# EAGLE design tactileSensorI2c (EAGLE 9.6.0)
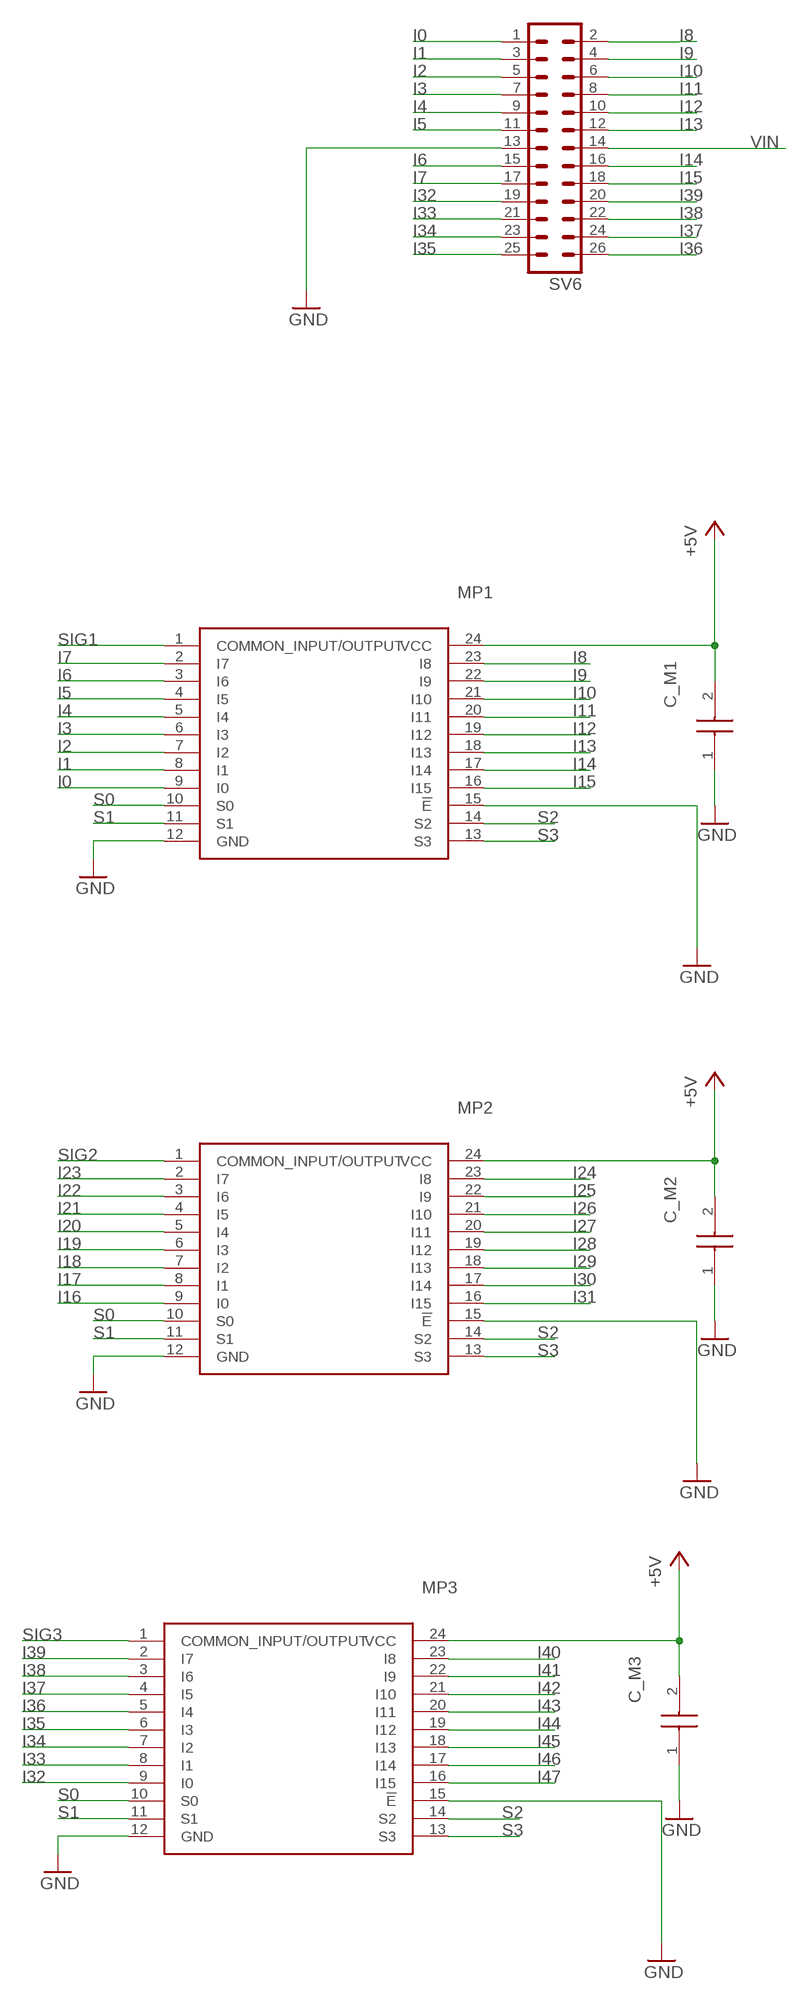
[diagram p0: schematic, sheet 1, part 1 of 2]
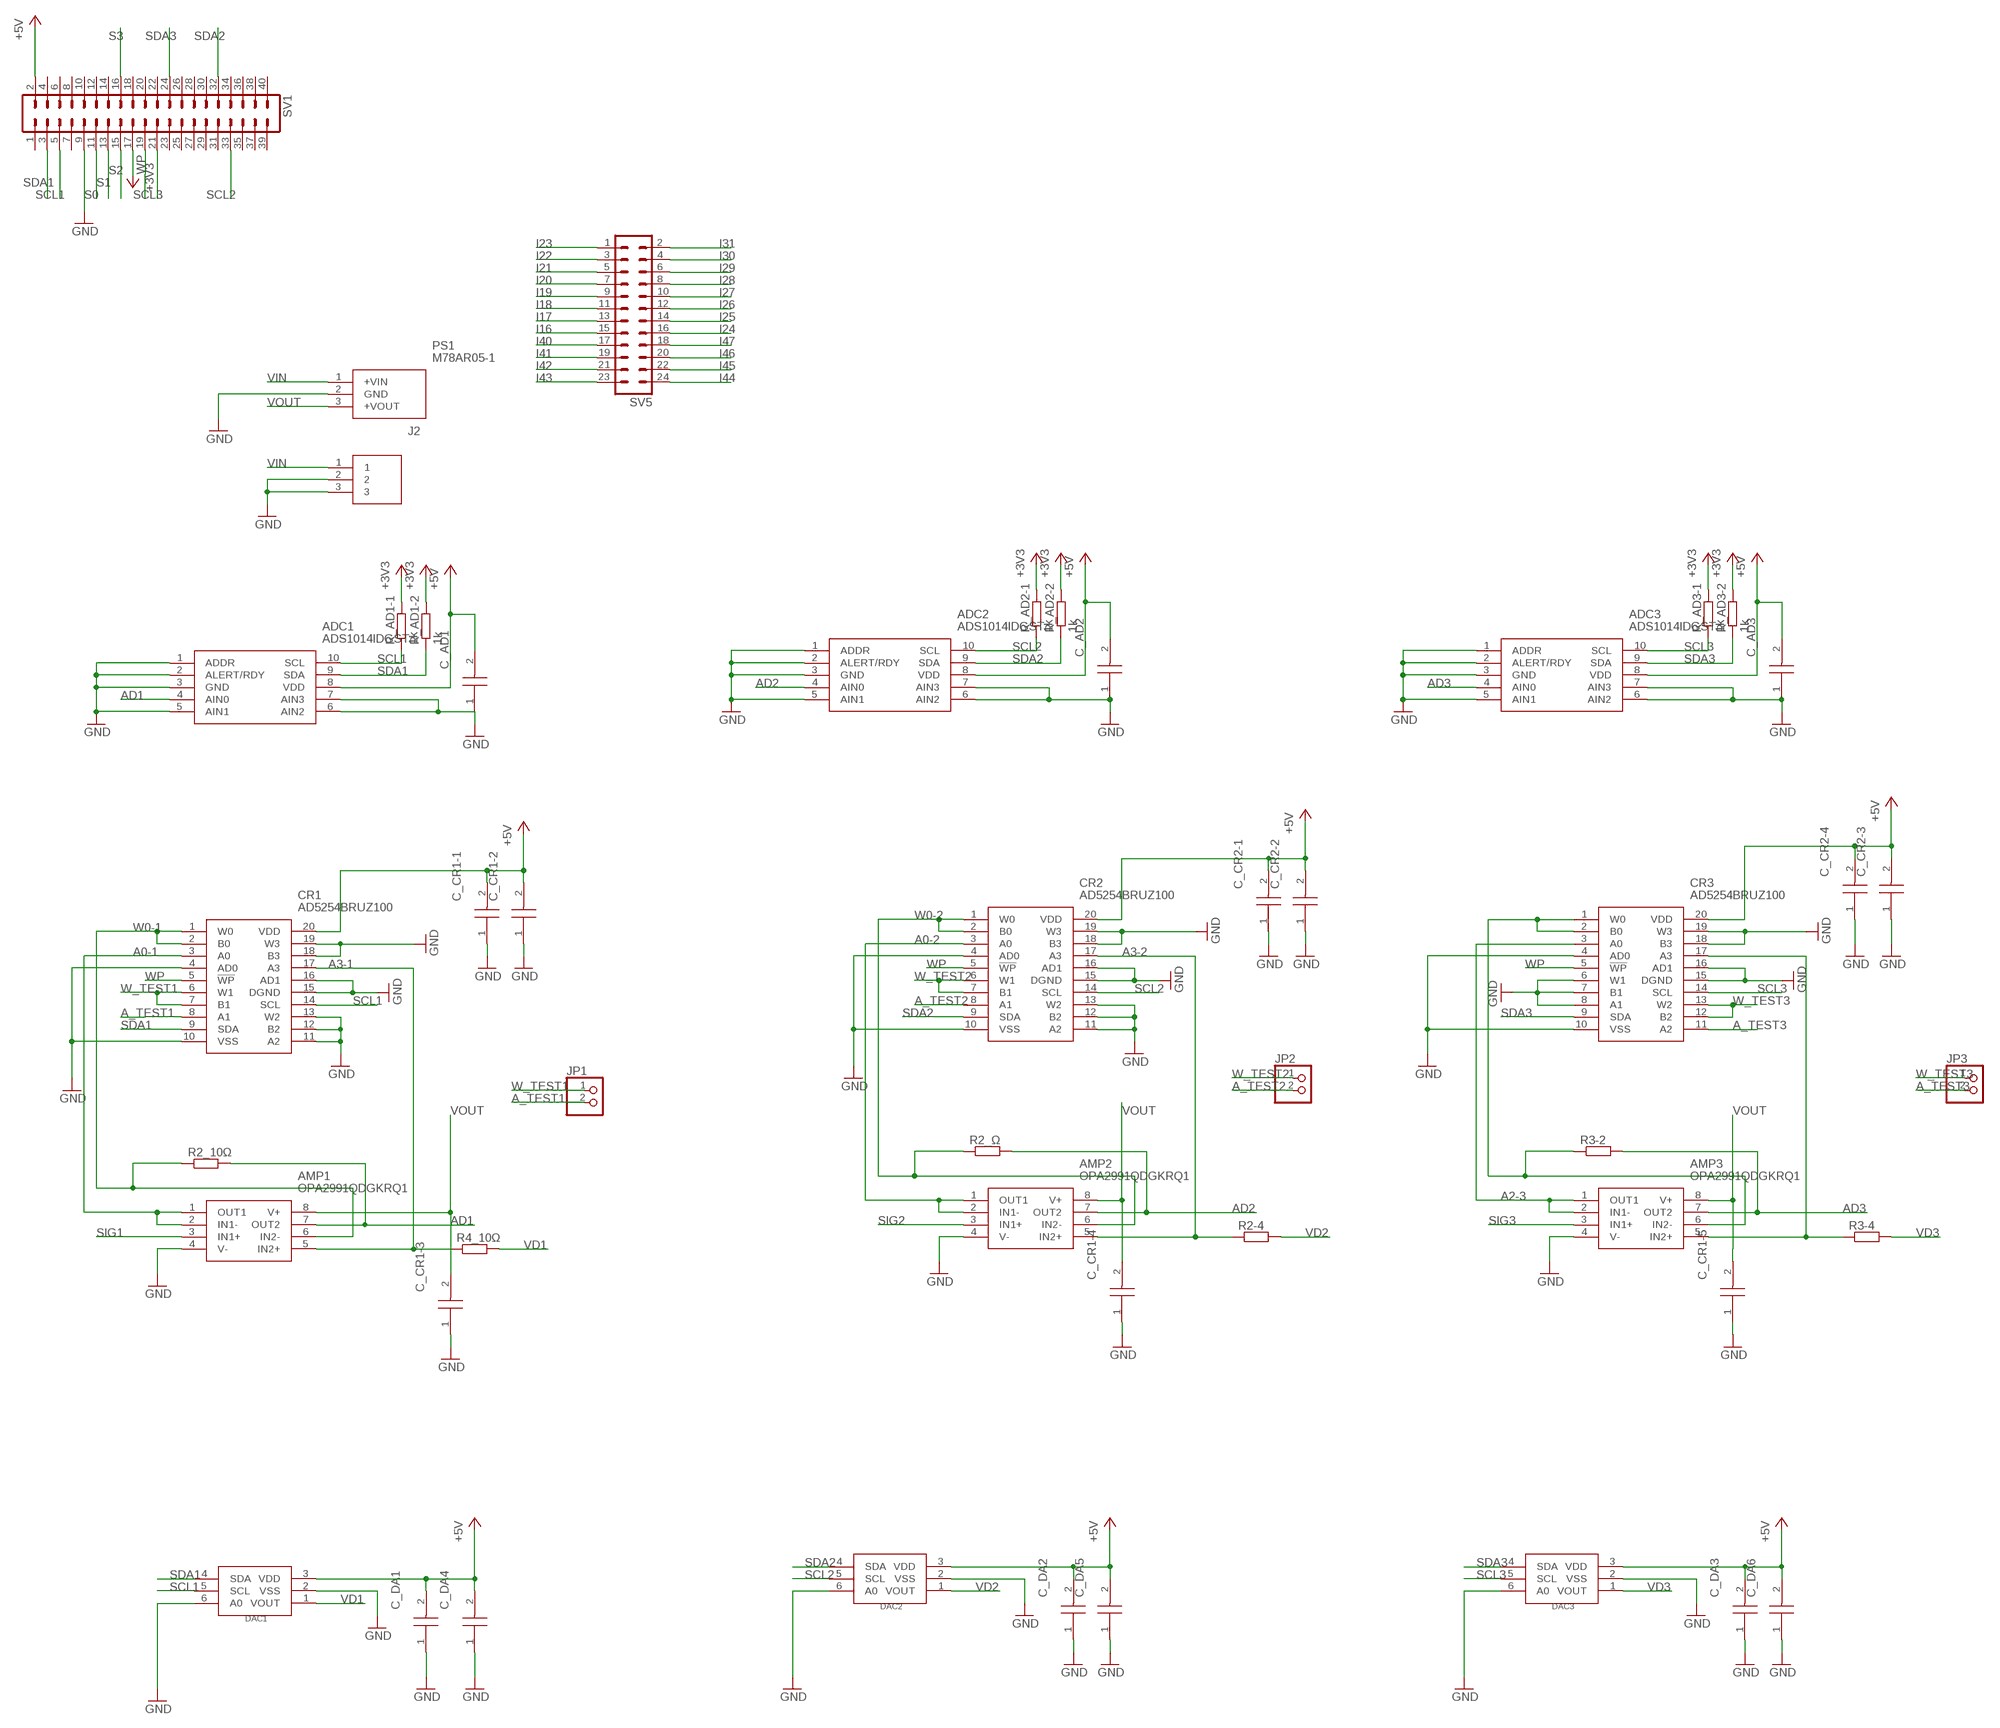
[diagram p1: schematic, sheet 1, part 2 of 2]

## Parts
ADC1  ADS1014IDGST  [SOP50P490X110-10N]
ADC2  ADS1014IDGST  [SOP50P490X110-10N]
ADC3  ADS1014IDGST  [SOP50P490X110-10N]
AMP1  OPA2991QDGKRQ1  [SOP65P490X110-8N]
AMP2  OPA2991QDGKRQ1  [SOP65P490X110-8N]
AMP3  OPA2991QDGKRQ1  [SOP65P490X110-8N]
C_AD1  0.1u  C0805C105J3RACTU  [CAPC2012X140N]
C_AD2  0.1u  C0805C105J3RACTU  [CAPC2012X140N]
C_AD3  0.1u  C0805C105J3RACTU  [CAPC2012X140N]
C_CR1-1  0.1u  C0805C105J3RACTU  [CAPC2012X140N]
C_CR1-2  10u  C0805C105J3RACTU  [CAPC2012X140N]
C_CR1-3  10u  C0805C105J3RACTU  [CAPC2012X140N]
C_CR1-4  10u  C0805C105J3RACTU  [CAPC2012X140N]
C_CR1-5  10u  C0805C105J3RACTU  [CAPC2012X140N]
C_CR2-1  0.1u  C0805C105J3RACTU  [CAPC2012X140N]
C_CR2-2  10u  C0805C105J3RACTU  [CAPC2012X140N]
C_CR2-3  C0805C105J3RACTU  [CAPC2012X140N]
C_CR2-4  C0805C105J3RACTU  [CAPC2012X140N]
C_DA1  C0805C105J3RACTU  [CAPC2012X140N]
C_DA2  C0805C105J3RACTU  [CAPC2012X140N]
C_DA3  C0805C105J3RACTU  [CAPC2012X140N]
C_DA4  C0805C105J3RACTU  [CAPC2012X140N]
C_DA5  C0805C105J3RACTU  [CAPC2012X140N]
C_DA6  C0805C105J3RACTU  [CAPC2012X140N]
C_M1  0.1u  C0805C105J3RACTU  [CAPC2012X140N]
C_M2  0.1u  C0805C105J3RACTU  [CAPC2012X140N]
C_M3  0.1u  C0805C105J3RACTU  [CAPC2012X140N]
CR1  AD5254BRUZ100  [SOP65P640X120-20N]
CR2  AD5254BRUZ100  [SOP65P640X120-20N]
CR3  AD5254BRUZ100  [SOP65P640X120-20N]
DAC1  MCP4725  [SOT23-6]
DAC2  MCP4725  [SOT23-6]
DAC3  MCP4725  [SOT23-6]
J2  1725669  [1725669]
JP1  PINHD-1X2  [1X02]
JP2  PINHD-1X2  [1X02]
JP3  PINHD-1X2  [1X02]
MP1  CD74HC4067SM96  [SOP65P780X200-24N]
MP2  CD74HC4067SM96  [SOP65P780X200-24N]
MP3  CD74HC4067SM96  [SOP65P780X200-24N]
PS1  M78AR05-1  [M78AR05]
R2-4  R-EU_0204/2V  [0204V]
R2_10Ω  R-EU_0204/2V  [0204V]
R2_Ω  R-EU_0204/2V  [0204V]
R3-2  R-EU_0204/2V  [0204V]
R3-4  R-EU_0204/2V  [0204V]
R4_10Ω  R-EU_0204/2V  [0204V]
R_AD1-1  1k  R-EU_R0805  [R0805]
R_AD1-2  1k  R-EU_R0805  [R0805]
R_AD2-1  1k  R-EU_R0805  [R0805]
R_AD2-2  1k  R-EU_R0805  [R0805]
R_AD3-1  1k  R-EU_R0805  [R0805]
R_AD3-2  1k  R-EU_R0805  [R0805]
SV1  MA20-2  [MA20-2]
SV5  MA12-2  [MA12-2]
SV6  MA13-2  [MA13-2]

## Nets
+3V3: R_AD1-1.2 R_AD1-2.2 R_AD2-1.2 R_AD2-2.2 R_AD3-1.2 R_AD3-2.2 SV1.17
+5V: ADC1.8(VDD) ADC2.8(VDD) ADC3.8(VDD) C_AD1.2 C_AD2.2 C_AD3.2 C_CR1-1.2 C_CR1-2.2 C_CR2-1.2 C_CR2-2.2 C_CR2-3.2 C_CR2-4.2 C_DA1.2 C_DA2.2 C_DA3.2 C_DA4.2 C_DA5.2 C_DA6.2 C_M1.2 C_M2.2 C_M3.2 CR1.20(VDD) CR2.20(VDD) CR3.20(VDD) DAC1.3(VDD) DAC2.3(VDD) DAC3.3(VDD) MP1.24(VCC) MP2.24(VCC) MP3.24(VCC) SV1.2
A0-1: AMP1.1(OUT1) AMP1.2(IN1-) CR1.3(A0)
A0-2: AMP2.1(OUT1) AMP2.2(IN1-) CR2.3(A0)
A1-3: AMP3.5(IN2+) CR3.17(A3) R3-4.1
A2-3: AMP3.1(OUT1) AMP3.2(IN1-) CR3.3(A0)
A3-1: AMP1.5(IN2+) CR1.17(A3) R4_10Ω.1
A3-2: AMP2.5(IN2+) CR2.17(A3) R2-4.1
A_TEST1: CR1.8(A1) JP1.2
A_TEST2: CR2.8(A1) JP2.2
A_TEST3: CR3.11(A2) JP3.2
AD1: ADC1.4(AIN0) AMP1.7(OUT2) R2_10Ω.2
AD2: ADC2.4(AIN0) AMP2.7(OUT2) R2_Ω.2
AD3: ADC3.4(AIN0) AMP3.7(OUT2) R3-2.2
GND: ADC1.1(ADDR) ADC1.2(ALERT/RDY) ADC1.3(GND) ADC1.5(AIN1) ADC1.6(AIN2) ADC1.7(AIN3) ADC2.1(ADDR) ADC2.2(ALERT/RDY) ADC2.3(GND) ADC2.5(AIN1) ADC2.6(AIN2) ADC2.7(AIN3) ADC3.1(ADDR) ADC3.2(ALERT/RDY) ADC3.3(GND) ADC3.5(AIN1) ADC3.6(AIN2) ADC3.7(AIN3) AMP1.4(V-) AMP2.4(V-) AMP3.4(V-) C_AD1.1 C_AD2.1 C_AD3.1 C_CR1-1.1 C_CR1-2.1 C_CR1-3.1 C_CR1-4.1 C_CR1-5.1 C_CR2-1.1 C_CR2-2.1 C_CR2-3.1 C_CR2-4.1 C_DA1.1 C_DA2.1 C_DA3.1 C_DA4.1 C_DA5.1 C_DA6.1 C_M1.1 C_M2.1 C_M3.1 CR1.4(AD0) CR1.10(VSS) CR1.11(A2) CR1.12(B2) CR1.13(W2) CR1.15(DGND) CR1.16(AD1) CR1.18(B3) CR1.19(W3) CR2.4(AD0) CR2.10(VSS) CR2.11(A2) CR2.12(B2) CR2.13(W2) CR2.15(DGND) CR2.16(AD1) CR2.18(B3) CR2.19(W3) CR3.4(AD0) CR3.6(W1) CR3.7(B1) CR3.8(A1) CR3.10(VSS) CR3.15(DGND) CR3.16(AD1) CR3.18(B3) CR3.19(W3) DAC1.2(VSS) DAC1.6(A0) DAC2.2(VSS) DAC2.6(A0) DAC3.2(VSS) DAC3.6(A0) J2.2 J2.3 MP1.12(GND) MP1.15(!E) MP2.12(GND) MP2.15(!E) MP3.12(GND) MP3.15(!E) PS1.2(GND) SV1.9 SV6.13
I0: MP1.9(I0) SV6.1
I1: MP1.8(I1) SV6.3
I2: MP1.7(I2) SV6.5
I3: MP1.6(I3) SV6.7
I4: MP1.5(I4) SV6.9
I5: MP1.4(I5) SV6.11
I6: MP1.3(I6) SV6.15
I7: MP1.2(I7) SV6.17
I8: MP1.23(I8) SV6.2
I9: MP1.22(I9) SV6.4
I10: MP1.21(I10) SV6.6
I11: MP1.20(I11) SV6.8
I12: MP1.19(I12) SV6.10
I13: MP1.18(I13) SV6.12
I14: MP1.17(I14) SV6.16
I15: MP1.16(I15) SV6.18
I16: MP2.9(I0) SV5.15
I17: MP2.8(I1) SV5.13
I18: MP2.7(I2) SV5.11
I19: MP2.6(I3) SV5.9
I20: MP2.5(I4) SV5.7
I21: MP2.4(I5) SV5.5
I22: MP2.3(I6) SV5.3
I23: MP2.2(I7) SV5.1
I24: MP2.23(I8) SV5.16
I25: MP2.22(I9) SV5.14
I26: MP2.21(I10) SV5.12
I27: MP2.20(I11) SV5.10
I28: MP2.19(I12) SV5.8
I29: MP2.18(I13) SV5.6
I30: MP2.17(I14) SV5.4
I31: MP2.16(I15) SV5.2
I32: MP3.9(I0) SV6.19
I33: MP3.8(I1) SV6.21
I34: MP3.7(I2) SV6.23
I35: MP3.6(I3) SV6.25
I36: MP3.5(I4) SV6.26
I37: MP3.4(I5) SV6.24
I38: MP3.3(I6) SV6.22
I39: MP3.2(I7) SV6.20
I40: MP3.23(I8) SV5.17
I41: MP3.22(I9) SV5.19
I42: MP3.21(I10) SV5.21
I43: MP3.20(I11) SV5.23
I44: MP3.19(I12) SV5.24
I45: MP3.18(I13) SV5.22
I46: MP3.17(I14) SV5.20
I47: MP3.16(I15) SV5.18
S0: MP1.10(S0) MP2.10(S0) MP3.10(S0) SV1.11
S1: MP1.11(S1) MP2.11(S1) MP3.11(S1) SV1.13
S2: MP1.14(S2) MP2.14(S2) MP3.14(S2) SV1.15
S3: MP1.13(S3) MP2.13(S3) MP3.13(S3) SV1.16
SCL1: ADC1.10(SCL) CR1.14(SCL) DAC1.5(SCL) R_AD1-1.1 SV1.5
SCL2: ADC2.10(SCL) CR2.14(SCL) DAC2.5(SCL) R_AD2-1.1 SV1.33
SCL3: ADC3.10(SCL) CR3.14(SCL) DAC3.5(SCL) R_AD3-1.1 SV1.21
SDA1: ADC1.9(SDA) CR1.9(SDA) DAC1.4(SDA) R_AD1-2.1 SV1.3
SDA2: ADC2.9(SDA) CR2.9(SDA) DAC2.4(SDA) R_AD2-2.1 SV1.32
SDA3: ADC3.9(SDA) CR3.9(SDA) DAC3.4(SDA) R_AD3-2.1 SV1.24
SIG1: AMP1.3(IN1+) MP1.1(COMMON_INPUT/OUTPUT)
SIG2: AMP2.3(IN1+) MP2.1(COMMON_INPUT/OUTPUT)
SIG3: AMP3.3(IN1+) MP3.1(COMMON_INPUT/OUTPUT)
VD1: DAC1.1(VOUT) R4_10Ω.2
VD2: DAC2.1(VOUT) R2-4.2
VD3: DAC3.1(VOUT) R3-4.2
VIN: J2.1 PS1.1(+VIN) SV6.14
VOUT: AMP1.8(V+) AMP2.8(V+) AMP3.8(V+) C_CR1-3.2 C_CR1-4.2 C_CR1-5.2 PS1.3(+VOUT)
W0-1: AMP1.6(IN2-) CR1.1(W0) CR1.2(B0) R2_10Ω.1
W0-2: AMP2.6(IN2-) CR2.1(W0) CR2.2(B0) R2_Ω.1
W1-3: AMP3.6(IN2-) CR3.1(W0) CR3.2(B0) R3-2.1
W_TEST1: CR1.6(W1) CR1.7(B1) JP1.1
W_TEST2: CR2.6(W1) CR2.7(B1) JP2.1
W_TEST3: CR3.12(B2) CR3.13(W2) JP3.1
WP: CR1.5(!WP) CR2.5(!WP) CR3.5(!WP) SV1.19
Unconnected: SV1.1 SV1.4 SV1.6 SV1.7 SV1.8 SV1.10 SV1.12 SV1.14 SV1.18 SV1.20 SV1.22 SV1.23 SV1.25 SV1.26 SV1.27 SV1.28 SV1.29 SV1.30 SV1.31 SV1.34 SV1.35 SV1.36 SV1.37 SV1.38 SV1.39 SV1.40

## Library data of the parts
ADC1-ADC3 = SamacSys_Parts:ADS1014IDGST: 12-Bit 3.3kSPS 1-Ch Delta-Sigma ADC With PGA, Oscillator, Voltage Reference, Comparator, and I2C Source: Datasheet <http://uk.rs-online.com/web/p/products/7094557P>; DESCRIPTION: 12-Bit 3.3kSPS 1-Ch Delta-Sigma ADC With PGA, Oscillator, Voltage Reference, Comparator, and I2C; HEIGHT: 1.1mm; MANUFACTURER_NAME: Texas Instruments; MANUFACTURER_PART_NUMBER: ADS1014IDGST; RS_PART_NUMBER: 7094557P; RS_PRICE-STOCK: http://uk.rs-online.com/web/p/products/7094557P
AMP1-AMP3 = SamacSys_Parts:OPA2991QDGKRQ1: Operational Amplifiers - Op Amps Automotive 2-channel, 40-V rail-to-rail input/output, low offset voltage, low noise op amp 8-VSSOP -40 to 125 Source: Datasheet <https://www.ti.com/lit/gpn/opa2991-q1>; DESCRIPTION: Operational Amplifiers - Op Amps Automotive&nbsp;2-channel, 40-V rail-to-rail input/output, low offset voltage, low noise op amp 8-VSSOP -40 to 125; HEIGHT: 1.1mm; MANUFACTURER_NAME: Texas Instruments; MANUFACTURER_PART_NUMBER: OPA2991QDGKRQ1
C_AD1-C_AD3 C_CR1-1-C_CR1-5 C_CR2-1-C_CR2-4 C_DA1-C_DA6 C_M1-C_M3 = SamacSys_Parts:C0805C105J3RACTU: KEMET - C0805C105J3RACTU - CAP, MLCC, X7R, 1UF, 25V, 0805 Source: Datasheet <http://uk.rs-online.com/web/p/products/1464275P>; DESCRIPTION: KEMET - C0805C105J3RACTU - CAP, MLCC, X7R, 1UF, 25V, 0805; HEIGHT: 1.4mm; MANUFACTURER_NAME: Kemet; MANUFACTURER_PART_NUMBER: C0805C105J3RACTU; RS_PART_NUMBER: 1464275P; RS_PRICE-STOCK: http://uk.rs-online.com/web/p/products/1464275P
CR1-CR3 = SamacSys_Parts:AD5254BRUZ100: AD5254BRUZ100, Digital Potentiometer 100k 256-Position Linear 4-channel Serial-2 Wire, Serial-I2C 20-Pin TSSOP Source: Datasheet <http://uk.rs-online.com/web/p/products/5384858P>; DESCRIPTION: AD5254BRUZ100, Digital Potentiometer 100k 256-Position Linear 4-channel Serial-2 Wire, Serial-I2C 20-Pin TSSOP; HEIGHT: 1.2mm; MANUFACTURER_NAME: Analog Devices; MANUFACTURER_PART_NUMBER: AD5254BRUZ100; RS_PART_NUMBER: 5384858P; RS_PRICE-STOCK: http://uk.rs-online.com/web/p/products/5384858P
DAC1-DAC3 = microchip-update-2:MCP4725: 12-Bit Digital-to-Analog Converter with EEPROM Memory in SOT-23-6
J2 = 1725669:1725669: 3 way PCB vertical mount terminal,2.54mm 3 way PCB vertical mount terminal,2.54mm Source: Datasheet <https://www.phoenixcontact.com/online/portal/gb?uri=pxc-oc-itemdetail:pid=1725669&library=gben&tab=1>; ARROW_PART_NUMBER: 1725669; ARROW_PRICE-STOCK: https://www.arrow.com/en/products/1725669/phoenix-contact?region=nac; DESCRIPTION: 3 way PCB vertical mount terminal,2.54mm 3 way PCB vertical mount terminal,2.54mm; HEIGHT: 8.5mm; MANUFACTURER_NAME: Phoenix Contact; MANUFACTURER_PART_NUMBER: 1725669; MOUSER_PART_NUMBER: 651-1725669; MOUSER_PRICE-STOCK: https://www.mouser.co.uk/ProductDetail/Phoenix-Contact/1725669?qs=A%2FKWGUWTCZjmkTL0Oe91ew%3D%3D
JP1-JP3 = pinhead:PINHD-1X2: PIN HEADER
MP1-MP3 = SamacSys_Parts:CD74HC4067SM96: High Speed CMOS 16-Ch MUX/DEMUX 24P SOIC CD74HC4067SM96, Multiplexer/Demultiplexer Single 16:1, 3 V, 5 V, 24-Pin, SSOP, 1 Source: Datasheet <http://docs-emea.rs-online.com/webdocs/0c95/0900766b80c95708.pdf>; ARROW_PART_NUMBER: CD74HC4067SM96; ARROW_PRICE-STOCK: https://www.arrow.com/en/products/cd74hc4067sm96/texas-instruments; DESCRIPTION: High Speed CMOS 16-Ch MUX/DEMUX 24P SOIC CD74HC4067SM96, Multiplexer/Demultiplexer Single 16:1, 3 V, 5 V, 24-Pin, SSOP, 1; HEIGHT: 2mm; MANUFACTURER_NAME: Texas Instruments; MANUFACTURER_PART_NUMBER: CD74HC4067SM96; MOUSER_PART_NUMBER: 595-CD74HC4067SM96; MOUSER_PRICE-STOCK: https://www.mouser.co.uk/ProductDetail/Texas-Instruments/CD74HC4067SM96?qs=JHHQeKcAU3DyfvAOSRLjhQ%3D%3D
PS1 = SamacSys_Parts:M78AR05-1: Switching Regulator 1A, SIP Package Source: Datasheet <https://www.minmax.com.tw/en/download/files/692/M78AR-1_Datasheet.pdf>; DESCRIPTION: Switching Regulator 1A, SIP Package; HEIGHT: mm; MANUFACTURER_NAME: Minmax; MANUFACTURER_PART_NUMBER: M78AR05-1
R2-4 R2_10Ω R2_Ω R3-2 R3-4 R4_10Ω R_AD1-1 R_AD1-2 R_AD2-1 R_AD2-2 R_AD3-1 R_AD3-2 = rcl:R-EU_: RESISTOR, European symbol; SPICEPREFIX: R
SV1 = con-lstb:MA20-2: PIN HEADER; OC_FARNELL: unknown; OC_NEWARK: unknown
SV5 = con-lstb:MA12-2: PIN HEADER; OC_FARNELL: unknown; OC_NEWARK: unknown
SV6 = con-lstb:MA13-2: PIN HEADER; OC_FARNELL: unknown; OC_NEWARK: unknown

## Board
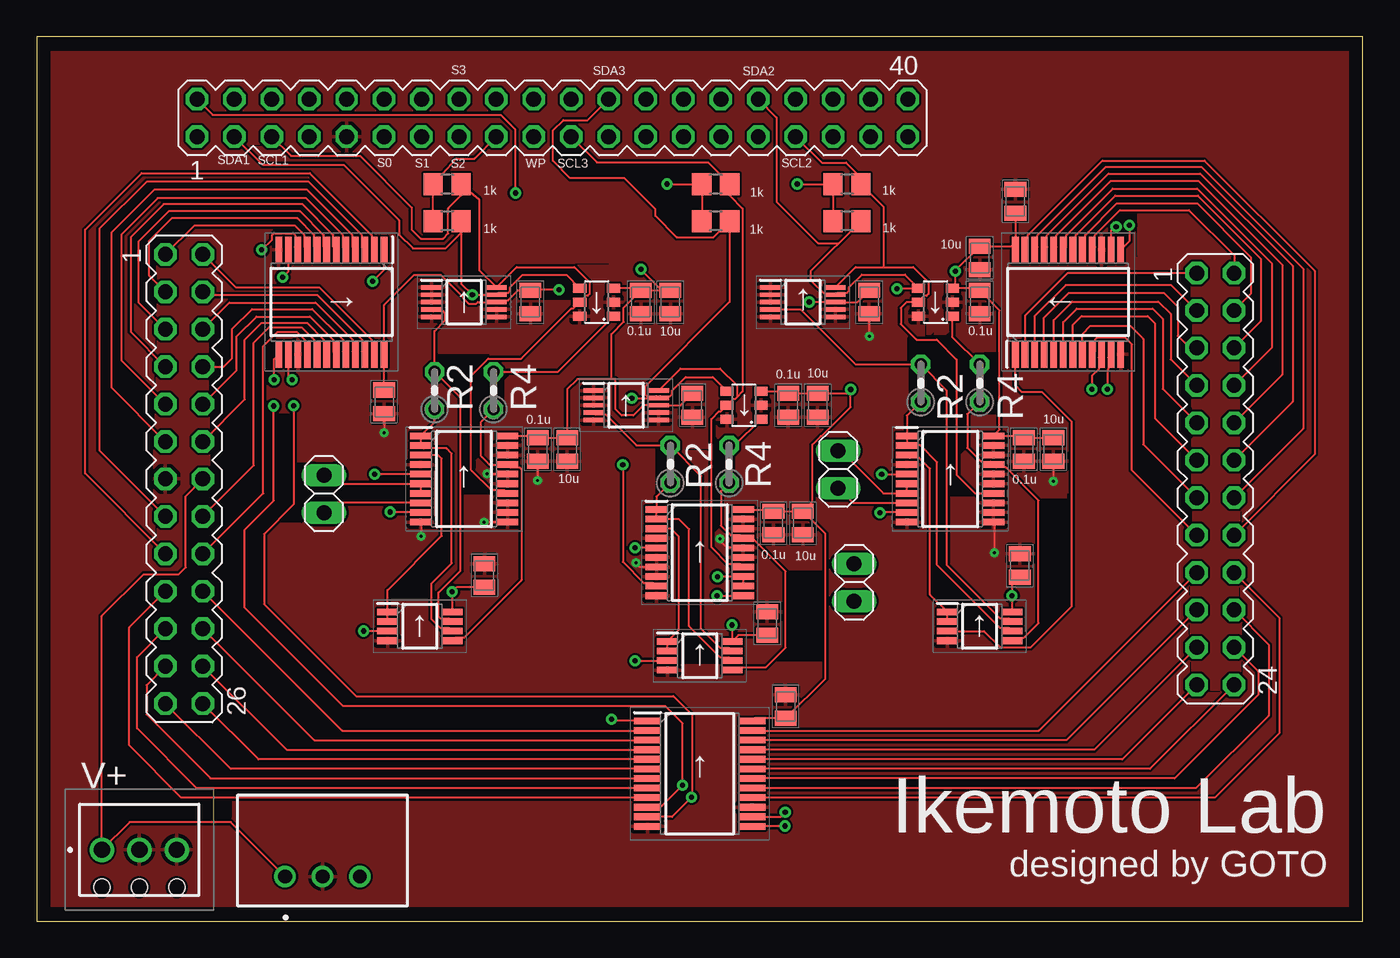
[diagram p2: board, top side]
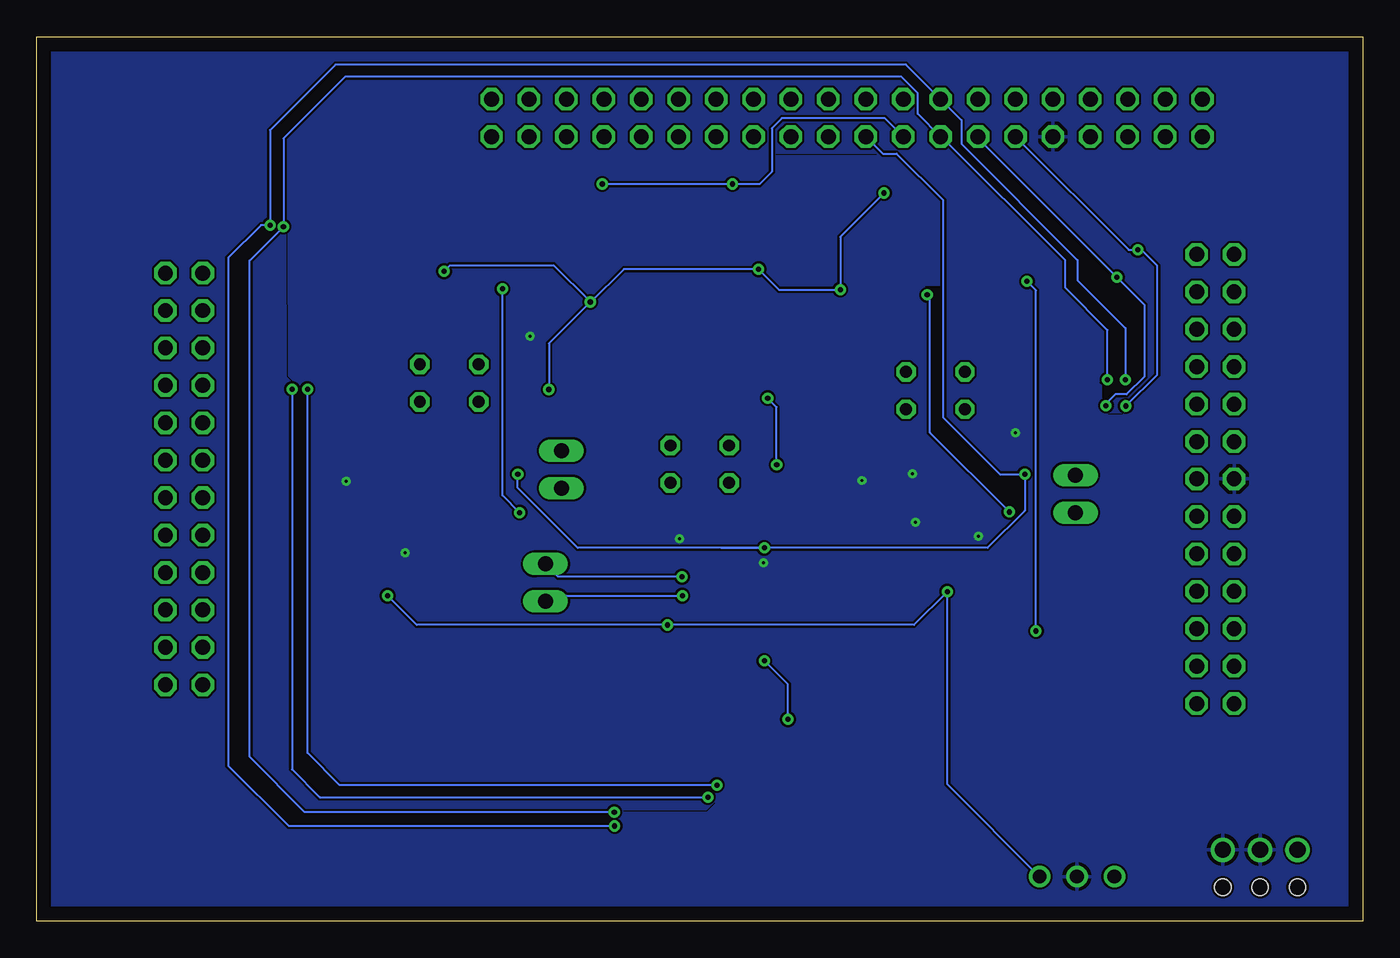
[diagram p3: board, bottom side, seen from below]

Size 90 x 60 mm. Coordinates in mm from the lower left corner, seen from the top.
Outline: 0,0 90,0 90,60 0,60 0,0
Copper layers (1*16): Top 0.035mm / dielectric 1.5mm / Bottom 0.035mm
Design rules "PCBGoGo": minimum track width 6mil, minimum drill 0.2mm, track to track 6mil, track to pad 6mil, pad to pad 6mil, via to via 6mil, smd to smd 6mil, copper to edge 0.2mm, drill to drill 6mil, minimum pad ring 10mil, minimum via ring 8mil, stop-mask expansion 4mil, vias tented up to drill 0mil, thermal gap 10mil
tRestrict: 126 lines
bRestrict: 11 lines

### Footprints (pad centres in the part's own frame; a part is rotated, then mirrored left to right if it is on the bottom)
SOP50P490X110-10N = smd 1.4 x 0.3: 1 -2.2,1; 2 -2.2,0.5; 3 -2.2,0; 4 -2.2,-0.5; 5 -2.2,-1; 6 2.2,-1; 7 2.2,-0.5; 8 2.2,0; 9 2.2,0.5; 10 2.2,1
SOP65P490X110-8N = smd 1.4 x 0.45: 1 -2.2,0.975; 2 -2.2,0.325; 3 -2.2,-0.325; 4 -2.2,-0.975; 5 2.2,-0.975; 6 2.2,-0.325; 7 2.2,0.325; 8 2.2,0.975
CAPC2012X140N = smd 1.02 x 1.47: 1 -0.8,0; 2 0.8,0
SOP65P640X120-20N = smd 1.475 x 0.45: 1 -2.938,2.925; 2 -2.938,2.275; 3 -2.938,1.625; 4 -2.938,0.975; 5 -2.938,0.325; 6 -2.938,-0.325; 7 -2.938,-0.975; 8 -2.938,-1.625; 9 -2.938,-2.275; 10 -2.938,-2.925; 11 2.938,-2.925; 12 2.938,-2.275; 13 2.938,-1.625; 14 2.938,-0.975; 15 2.938,-0.325; 16 2.938,0.325; 17 2.938,0.975; 18 2.938,1.625; 19 2.938,2.275; 20 2.938,2.925
SOT23-6 = smd 0.6 x 0.9: 1 -0.95,-1.15; 2 0,-1.15; 3 0.95,-1.15; 4 0.95,1.15; 5 0,1.15; 6 -0.95,1.15
1725669 = drill 1.1 pad 1.65: 1 0,0; 2 2.54,0; 3 5.08,0 | hole 1.1: 0,-2.54; 2.54,-2.54; 5.08,-2.54
1X02 = drill 1.016 long: 1 -1.27,0; 2 1.27,0
SOP65P780X200-24N = smd 1.8 x 0.45: 1 -3.55,3.575; 2 -3.55,2.925; 3 -3.55,2.275; 4 -3.55,1.625; 5 -3.55,0.975; 6 -3.55,0.325; 7 -3.55,-0.325; 8 -3.55,-0.975; 9 -3.55,-1.625; 10 -3.55,-2.275; 11 -3.55,-2.925; 12 -3.55,-3.575; 13 3.55,-3.575; 14 3.55,-2.925; 15 3.55,-2.275; 16 3.55,-1.625; 17 3.55,-0.975; 18 3.55,-0.325; 19 3.55,0.325; 20 3.55,0.975; 21 3.55,1.625; 22 3.55,2.275; 23 3.55,2.925; 24 3.55,3.575
M78AR05 = drill 0.94 pad 1.44: 1 -2.54,2; 2 0,2; 3 2.54,2
0204V = drill 0.813 octagon: 1 -1.27,0; 2 1.27,0
R0805 = smd 1.3 x 1.5: 1 -0.95,0; 2 0.95,0
MA20-2 = drill 1.016 octagon: 1 -24.13,-1.27; 2 -24.13,1.27; 3 -21.59,-1.27; 4 -21.59,1.27; 5 -19.05,-1.27; 6 -19.05,1.27; 7 -16.51,-1.27; 8 -16.51,1.27; 9 -13.97,-1.27; 10 -13.97,1.27; 11 -11.43,-1.27; 12 -11.43,1.27; 13 -8.89,-1.27; 14 -8.89,1.27; 15 -6.35,-1.27; 16 -6.35,1.27; 17 -3.81,-1.27; 18 -3.81,1.27; 19 -1.27,-1.27; 20 -1.27,1.27; 21 1.27,-1.27; 22 1.27,1.27; 23 3.81,-1.27; 24 3.81,1.27; 25 6.35,-1.27; 26 6.35,1.27; 27 8.89,-1.27; 28 8.89,1.27; 29 11.43,-1.27; 30 11.43,1.27; 31 13.97,-1.27; 32 13.97,1.27; 33 16.51,-1.27; 34 16.51,1.27; 35 19.05,-1.27; 36 19.05,1.27; 37 21.59,-1.27; 38 21.59,1.27; 39 24.13,-1.27; 40 24.13,1.27
MA12-2 = drill 1.016 octagon: 1 -13.97,-1.27; 2 -13.97,1.27; 3 -11.43,-1.27; 4 -11.43,1.27; 5 -8.89,-1.27; 6 -8.89,1.27; 7 -6.35,-1.27; 8 -6.35,1.27; 9 -3.81,-1.27; 10 -3.81,1.27; 11 -1.27,-1.27; 12 -1.27,1.27; 13 1.27,-1.27; 14 1.27,1.27; 15 3.81,-1.27; 16 3.81,1.27; 17 6.35,-1.27; 18 6.35,1.27; 19 8.89,-1.27; 20 8.89,1.27; 21 11.43,-1.27; 22 11.43,1.27; 23 13.97,-1.27; 24 13.97,1.27
MA13-2 = drill 1.016 octagon: 1 -15.24,-1.27; 2 -15.24,1.27; 3 -12.7,-1.27; 4 -12.7,1.27; 5 -10.16,-1.27; 6 -10.16,1.27; 7 -7.62,-1.27; 8 -7.62,1.27; 9 -5.08,-1.27; 10 -5.08,1.27; 11 -2.54,-1.27; 12 -2.54,1.27; 13 0,-1.27; 14 0,1.27; 15 2.54,-1.27; 16 2.54,1.27; 17 5.08,-1.27; 18 5.08,1.27; 19 7.62,-1.27; 20 7.62,1.27; 21 10.16,-1.27; 22 10.16,1.27; 23 12.7,-1.27; 24 12.7,1.27; 25 15.24,-1.27; 26 15.24,1.27

### Placement (x,y rotation side)
ADC1  29,42 0 top
ADC2  52,42 0 top
ADC3  40,35 0 top
AMP1  26,20 0 top
AMP2  64,20 0 top
AMP3  45,18 0 top
C_AD1  33.5,42 90 top
C_AD2  56.5,42 90 top
C_AD3  44.5,35 90 top
C_CR1-1  34,32 90 top
C_CR1-2  36,32 90 top
C_CR1-3  30.39,23.46 270 top
C_CR1-4  49.58,20.2 270 top
C_CR1-5  66.73,24.12 270 top
C_CR2-1  69,32 90 top
C_CR2-2  67,32 90 top
C_CR2-3  50,27 90 top
C_CR2-4  52,27 90 top
C_DA1  41,42 90 top
C_DA2  64,42 90 top
C_DA3  51,35 90 top
C_DA4  43,42 90 top
C_DA5  64,45 90 top
C_DA6  53,35 90 top
C_M1  23.58,35.23 90 top
C_M2  66.42,48.84 270 top
C_M3  50.83,14.56 270 top
CR1  29,30 0 top
CR2  62,30 0 top
CR3  45,25 0 top
DAC1  38,42 90 top
DAC2  61,42 90 top
DAC3  48,35 90 top
J2  4.42,4.83 0 top
JP1  19.49,28.99 270 top
JP2  54.39,30.65 270 top
JP3  55.48,22.97 270 top
MP1  20,42 270 top
MP2  70,42 90 top
MP3  45,10 0 top
PS1  19.39,1.02 0 top
R2-4  64,36.5 90 top
R2_10Ω  27,36 90 top
R2_Ω  60,36.5 90 top
R3-2  43,31 90 top
R3-4  47,31 90 top
R4_10Ω  31,36 90 top
R_AD1-1  27.86,50 180 top
R_AD1-2  27.86,47.5 180 top
R_AD2-1  55,50 180 top
R_AD2-2  55,47.5 180 top
R_AD3-1  46.09,50 180 top
R_AD3-2  46.09,47.5 180 top
SV1  35,54.5 0 top
SV5  80,30 270 top
SV6  10,30 270 top

### Tracks (layer width: path | path; a pad name or v marks a point on that pad's centre or on a via)
+3V3  (via drill 0.35)
  Top 0.152: SV1.17 29.7,51.74 28.46,51.74 26.95,50.05 R_AD1-1.2 R_AD1-2.2 | v51.61,50.01 54.04,50.01 R_AD2-1.2 R_AD2-2.2 | v42.77,50.01 45.13,50.01 R_AD3-1.2 R_AD3-2.2
  Bottom 0.152: SV1.17 32.44,54.48 39.42,54.48 40.11,53.8 40.11,50.85 40.95,50.01 v42.77,50.01 v51.61,50.01
+5V  (via drill 0.35)
  Top 0.152: SV1.2 11.93,54.71 31.47,54.71 32.49,53.7 v32.49,49.4 | C_M2.2 MP2.24 66.17,45.8 C_DA5.2 62.36,44.16 v62.36,44.09 62.36,43.16 DAC2.3 63.85,42.95 C_DA2.2 65.35,41.45 65.35,33.34 CR2.20 66.88,32.92 C_CR2-2.2 C_CR2-1.2 | MP3.24 48.74,13.76 C_M3.2 53.52,16.45 53.52,26.28 C_CR2-4.2 | CR1.20 33.88,32.92 C_CR1-1.2 C_CR1-2.2 36,36.08 36.7,36.78 39,36.78 | DAC1.3 40.85,42.95 C_DA1.2 | C_M1.2 MP1.24 23.57,41.81 25.6,43.84 27.41,43.84 28.96,42.29 28.96,42.24 29.31,41.89 29.82,41.89 29.93,42 ADC1.8 31.32,42.12 32,42.12 32.67,42.8 C_AD1.2 33.55,42.85 v35.46,42.85 | CR3.20 49.88,27.93 C_CR2-3.2 C_CR2-4.2 | C_AD3.2 43.7,35 ADC3.8 41.17,35 40.49,34.31 39.7,34.31 39.29,34.72 39.29,36.78 39,36.78 | C_AD2.2 55.7,42 ADC2.8 54.19,42.01 v52.43,42.01 | v41.01,44.23 41,44.22 42.42,42.8 C_DA4.2 C_DA1.2 | DAC3.3 50.85,35.95 C_DA3.2 C_DA6.2 54.98,35.8 v55.24,36.07 v55.23,36.08 55.23,34.87 53.27,32.91 53.22,32.91 52.64,32.33 52.64,28.44 C_CR2-4.2 | C_DA1.2 39.83,41.63 39.83,40.66 39,39.83 39,36.78
  Bottom 0.152: v32.49,49.4 35.46,46.43 v35.46,42.85 39.62,42.85 v41.01,44.23 50.15,44.23 52.4,41.99 v52.43,42.01 | v62.36,44.09 61.95,44.5 54.91,44.5 v52.43,42.01 | v52.43,42.01 55.24,39.19 v55.24,36.07
A0-1
  Top 0.152: AMP1.2 AMP1.1 23.8,22.45 27.48,26.13 27.48,31.37 27.23,31.62 CR1.3
A0-2
  Top 0.152: AMP2.2 AMP2.1 60.63,22.14 60.63,30.69 59.89,31.43 59.26,31.43 CR2.3
A1-3
  Top 0.152: R3-4.1 46.44,29.17 46.44,26.84 47.11,26.17 47.74,26.17 CR3.17 48.57,25.98 50.83,23.72 50.83,18.55 49.49,17.22 47.4,17.22 AMP3.5
A2-3
  Top 0.152: CR3.3 43.05,26.62 43.59,26.09 43.59,19.76 AMP3.1 AMP3.2
A3-1
  Top 0.152: AMP1.5 28.4,19.22 29,19.22 32.9,23.13 32.9,30.64 32.77,30.78 32.13,30.78 CR1.17 30.72,30.98 30.15,31.55 30.15,33.88 R4_10Ω.1
A3-2
  Top 0.152: AMP2.5 66.4,19.22 67,19.22 68,20.22 68,28.55 65.77,30.78 65.13,30.78 CR2.17 64.74,31.17 64.11,31.17 63.16,32.12 63.16,34.39 R2-4.1
A_TEST1
  Top 0.152: CR1.8 20.15,28.38 JP1.2
A_TEST2
  Top 0.152: JP2.2 55.39,28.38 CR2.8
A_TEST3  (via drill 0.35)
  Top 0.152: v46.18,22.07 CR3.11
  Bottom 0.152: JP3.2 55.11,22.07 v46.18,22.07
AD1
  Top 0.152: ADC1.4 26.92,41.38 27.59,41.38 27.73,41.24 27.73,40.76 27,40.03 R2_10Ω.2 28.75,35.52 28.75,23.77 27.27,22.29 27.27,20.66 27.41,20.52 28,20.52 AMP1.7
AD2
  Top 0.152: AMP2.7 66,20.52 65.41,20.52 61.77,24.15 61.77,36 R2_Ω.2 55.58,37.77 51.84,41.5 ADC2.4
AD3
  Top 0.152: AMP3.7 47,18.52 46.41,18.52 45.09,19.84 45.09,30.18 R3-2.2 40.7,32.27 38.59,34.38 37.92,34.38 ADC3.4
GND  (via drill 0.2, 0.2 pad 0.55)
  Top 0.152: CR2.11 65,27.01 v65,25 | C_CR1-1.1 34,29.91 v33.98,29.9 | CR1.16 30.53,30.32 30.53,30.33 v30.57,30.36 | CR1.11 v30.35,27.07 v30.35,27.08 | CR1.10 26.09,27.05 v26.09,26.11 | C_M1.1 v23.58,33.15 v23.57,33.15 | CR3.16 46.86,25.32 46.39,25.8 v46.39,25.93 | C_AD2.1 56.5,39.69 v56.52,39.67 | CR3.7 40.95,24.02 40.66,24.31 v40.68,24.33 | C_CR2-1.1 69,29.88 68.99,29.87 v69,29.86
  pour Top: 1,59 89,59 89,1 1,1
  pour Bottom: 1,59 1,1 89,1 89,59
I0
  Top 0.152: MP1.9 18.18,45.75 18.18,46.55 17.53,47.19 10.68,47.19 SV6.1
I1
  Top 0.152: MP1.8 18.83,45.75 18.83,46.55 17.7,47.68 9.14,47.68 7.59,46.13 7.59,43.84 SV6.3
I2
  Top 0.152: MP1.7 19.48,45.75 19.48,46.55 17.86,48.16 8.94,48.16 6.88,46.1 6.88,42.01 SV6.5
I3
  Top 0.152: MP1.6 20.13,45.75 20.13,46.55 18.03,48.64 8.61,48.64 6.38,46.41 6.38,39.98 SV6.7
I4
  Top 0.152: MP1.5 20.78,45.75 20.78,46.55 18.28,49.05 8.2,49.05 5.74,46.58 5.74,38.07 SV6.9
I5
  Top 0.152: MP1.4 21.43,45.75 21.43,46.55 18.34,49.63 7.98,49.63 5.05,46.71 5.05,36.22 SV6.11
I6
  Top 0.152: MP1.3 22.08,45.75 22.08,46.55 18.46,50.16 7.44,50.16 4.24,46.96 4.24,31.95 SV6.15
I7
  Top 0.152: SV6.17 3.28,30.37 3.28,44 3.28,46.91 7.11,50.75 18.52,50.75 22.73,46.55 22.73,45.75 MP1.2
I8
  Top 0.152: SV6.2 13.51,43.01 19.17,43.01 22.73,39.45 22.73,38.65 MP1.23
I9
  Top 0.152: MP1.22 22.08,38.65 22.08,39.45 19.05,42.47 11.5,42.47 SV6.4
I10
  Top 0.152: SV6.6 13.07,41.96 18.91,41.96 21.43,39.45 21.43,38.65 MP1.21
I11
  Top 0.152: SV6.8 12.68,37.62 13.26,38.2 13.26,40.18 14.61,41.53 18.69,41.53 20.78,39.45 20.78,38.65 MP1.20
I12
  Top 0.152: SV6.10 13.56,37.37 13.56,39.67 14.91,41.02 18.55,41.02 20.13,39.45 20.13,38.65 MP1.19
I13
  Top 0.152: SV6.12 14.12,35.39 14.12,39.45 15.27,40.59 18.33,40.59 19.48,39.45 19.48,38.65 MP1.18
I14
  Top 0.152: SV6.16 14.73,30.92 14.73,39.24 15.77,40.28 17.99,40.28 18.83,39.45 18.83,38.65 MP1.17
I15
  Top 0.152: SV6.18 15.37,29.02 15.37,39.01 16.33,39.98 17.64,39.98 18.38,39.25 MP1.16
I16
  Top 0.152: SV5.15 74.35,30.57 74.35,39.13 73.89,39.58 71.95,39.58 71.82,39.45 71.82,38.65 MP2.9
I17
  Top 0.152: MP2.8 70.97,39.84 71.53,40.39 74.22,40.39 75.11,39.5 75.11,32.35 SV5.13
I18
  Top 0.152: MP2.7 70.33,40.45 70.92,41.05 75.41,41.05 75.89,40.56 75.89,34.1 SV5.11
I19
  Top 0.152: MP2.6 69.67,40.64 70.59,41.55 75.74,41.55 76.43,40.87 76.43,36.11 SV5.9
I20
  Top 0.152: MP2.5 69.03,40.78 70.28,42.04 76.12,42.04 76.96,41.2 76.96,38.12 SV5.7
I21
  Top 0.152: MP2.4 68.38,40.94 70.05,42.62 76.5,42.62 77.44,41.68 77.44,39.7 78.25,38.89 SV5.5
I22
  Top 0.152: SV5.3 77,43.16 69.85,43.16 67.72,41.03 MP2.3
I23
  Top 0.152: SV5.1 69.97,43.97 67.08,41.08 MP2.2
I24
  Top 0.152: MP2.23 67.27,45.75 67.27,46.55 72.33,51.61 79.25,51.61 86.74,44.12 86.74,31.66 SV5.16
I25
  Top 0.152: MP2.22 67.92,45.75 67.92,46.55 72.55,51.17 79.05,51.17 85.95,44.27 85.95,33.41 SV5.14
I26
  Top 0.152: MP2.21 68.57,45.75 68.57,46.55 72.74,50.72 78.97,50.72 85.24,44.45 85.24,35.24 SV5.12
I27
  Top 0.152: MP2.20 69.22,45.75 69.22,46.55 72.91,50.23 78.85,50.23 84.53,44.55 84.53,37.07 SV5.10
I28
  Top 0.152: MP2.19 69.87,45.75 69.87,46.55 73.03,49.7 78.77,49.7 83.82,44.65 83.82,38.9 SV5.8
I29
  Top 0.152: MP2.18 70.52,45.75 70.52,46.55 73.19,49.22 78.82,49.22 83.08,44.96 83.08,40.7 SV5.6
I30
  Top 0.152: MP2.17 71.17,45.75 71.17,46.55 73.32,48.7 78.76,48.7 82.32,45.14 82.4,45.06 82.4,42.56 SV5.4
I31
  Top 0.152: MP2.16 71.82,45.75 71.82,46.55 73.52,48.25 78.21,48.25 81.27,45.19 SV5.2
I32
  Top 0.152: MP3.9 9.81,8.38 6.27,11.91 6.27,19.92 SV6.19
I33
  Top 0.152: MP3.8 10.86,9.03 6.81,13.08 6.81,17.92 SV6.21
I34
  Top 0.152: SV6.23 7.44,16.01 7.44,14.02 11.79,9.68 MP3.7
I35
  Top 0.152: MP3.6 13.16,10.32 SV6.25
I36
  Top 0.152: MP3.5 15.05,10.97 SV6.26
I37
  Top 0.152: SV6.24 16.95,11.62 MP3.4
I38
  Top 0.152: SV6.22 18.84,12.28 MP3.3
I39
  Top 0.152: SV6.20 20.73,12.93 MP3.2
I40
  Top 0.152: MP3.23 68,12.93 SV5.17
I41
  Top 0.152: SV5.19 69.89,12.28 MP3.22
I42
  Top 0.152: SV5.21 71.78,11.62 MP3.21
I43
  Top 0.152: SV5.23 73.67,10.97 MP3.20
I44
  Top 0.152: SV5.24 75.56,10.32 MP3.19
I45
  Top 0.152: SV5.22 82.91,16.93 82.91,15.34 77.24,9.68 MP3.18
I46
  Top 0.152: SV5.20 83.62,18.76 83.62,13.95 78.69,9.02 48.56,9.02 MP3.17
I47
  Top 0.152: SV5.18 84.35,20.57 84.35,12.75 79.98,8.38 MP3.16
S0  (via drill 0.35)
  Top 0.152: v15.27,45.54 15.97,46.25 15.97,46.55 16.11,46.68 17.39,46.68 17.53,46.55 17.53,45.75 MP1.10 | MP3.10 42.34,7.72 v43.84,9.22 43.84,13.41 42.67,14.58 20.8,14.58 14.12,21.26 14.12,26.57 16.08,28.52 v16.08,34.95 | MP2.10 72.08,38.25 72.08,37.45 71.63,37.01 v71.63,36.09
  Bottom 0.152: SV1.11 15.88,45.54 v15.27,45.54 15.04,45.54 13.95,44.45 13.95,37.08 v16.08,34.95 | v43.84,9.22 69.44,9.22 71.63,11.4 v71.63,36.09
S1  (via drill 0.35)
  Top 0.152: MP1.11 17.07,44.08 v16.69,43.69 | MP3.11 43.12,7.08 v44.45,8.41 44.48,8.43 44.48,13.99 43.2,15.27 21.67,15.27 15.42,21.51 15.42,26.26 17.42,28.27 v17.42,34.98 | MP2.11 72.73,38.25 72.73,37.45 72.67,37.4 v72.67,36.09
  Bottom 0.152: SV1.13 26.11,53.11 v16.69,43.69 14.83,41.83 14.83,36.93 16.03,35.74 16.79,35.74 17.42,35.1 v17.42,34.98 | v72.67,36.09 72.67,10.29 70.79,8.41 v44.45,8.41
S2  (via drill 0.35)
  Top 0.152: MP1.14 17.07,36.98 v17.31,36.74 v17.32,36.74 | MP2.14 72.92,46.87 73.19,47.12 v73.26,47.12 | MP3.14 50.48,7.08 v50.8,7.39
  Bottom 0.152: v17.32,36.74 17.32,40.11 20.19,42.98 20.19,44.83 28.59,53.23 SV1.15 30.2,54.78 30.2,56.18 31.3,57.28 69.09,57.28 73.26,53.11 v73.26,47.12 75.56,44.82 75.56,11.15 71.81,7.39 v50.8,7.39
S3  (via drill 0.35)
  Top 0.152: v16.1,36.73 16.1,38.13 MP1.13 | v74.17,47.22 74.17,46.14 MP2.13 | v50.77,6.45 50.75,6.42 MP3.13
  Bottom 0.152: v16.1,36.73 16.1,40.23 19.36,43.48 19.36,44.86 27.23,52.73 27.23,54.35 SV1.16 31,58.12 69.72,58.12 74.17,53.67 v74.17,47.22 74.78,47.22 77,45 77,10.55 72.9,6.45 v50.77,6.45
SCL1
  Top 0.152: CR1.14 31.74,29.22 30.85,29.22 29.49,30.58 29.49,37.02 30.63,38.16 32.89,38.16 36.3,41.58 36.43,41.58 DAC1.5 37.27,42.42 37.4,42.42 37.53,42.55 37.53,43.34 36.5,44.37 32.57,44.37 ADC1.10 30.02,44.18 30.02,48.97 R_AD1-1.1 28.81,49.24 27.93,48.35 27.93,46.66 27.58,46.3 26.06,46.3 25.45,46.91 25.45,48.41 21.95,51.92 17.26,51.92 SV1.5
SCL2
  Top 0.152: DAC2.5 59.79,42 | 59.79,42 59.04,42 58.65,41.6 58.65,40.51 59.72,39.45 61.09,39.45 62.43,38.1 62.43,30.28 63.69,29.02 CR2.14 | ADC2.10 55.57,44.37 57.48,44.37 | 59.79,42 60.21,42.42 60.4,42.42 60.53,42.55 60.53,43.34 59.5,44.37 57.48,44.37 | SV1.33 53.28,51.46 54.94,51.46 55.95,50.45 R_AD2-1.1 57.48,48.47 57.48,44.37
SCL3
  Top 0.152: CR3.14 47.74,24.22 46.93,24.22 45.78,25.37 45.78,34.05 46.3,34.58 46.43,34.58 DAC3.5 47.27,35.42 47.4,35.42 47.53,35.55 | ADC3.10 43.69,37.49 46.38,37.49 47.53,36.34 47.53,35.55 | SV1.21 38.01,51.49 45.55,51.49 R_AD3-1.1 47.04,49.22 47.91,48.34 47.91,35.94 47.53,35.55
SDA1  (via drill 0.35)
  Top 0.152: v23.98,27.76 24.02,27.73 CR1.9 | SV1.3 15.33,51.31 20.83,51.31 24.59,47.55 24.59,46.58 25.53,45.64 27.74,45.64 28.81,46.71 R_AD1-2.1 28.81,43.25 v29.57,42.49 v29.57,42.5 ADC1.9 31.32,42.62 32,42.62 32.13,42.76 32.13,43 32.97,43.84 35.96,43.84 DAC1.4
  Bottom 0.152: v23.98,27.76 29.36,33.14 29.36,42.29 v29.57,42.49
SDA2  (via drill 0.35)
  Top 0.152: CR2.9 57.24,27.73 v57.23,27.71 | v58.4,42.9 58.44,42.95 DAC2.4 58.93,43.87 56,43.87 55.13,43 55.13,42.76 54.99,42.62 54.32,42.62 ADC2.9 53.53,42.5 52.53,43.5 52.53,44.08 R_AD2-2.1 54.45,46 53.01,46 50.22,48.79 50.22,54.52 SV1.32
  Bottom 0.152: v57.23,27.71 58.4,28.88 v58.4,42.9
SDA3  (via drill 0.35)
  Top 0.152: CR3.9 41.87,22.92 41.23,22.92 39.78,24.38 v39.78,30.96 | v40.39,35.48 42.18,35.48 | 42.18,35.48 ADC3.9 42.32,35.62 42.99,35.62 43.13,35.76 43.13,36 44.04,36.91 45.89,36.91 DAC3.4 | 42.18,35.48 42.05,35.62 41.41,35.62 41.27,35.76 41.27,36.24 47.04,42.01 R_AD3-2.1 45.94,46.41 43.43,46.41 41.99,47.85 41.99,48.31 39.88,50.42 36.2,50.42 35.03,51.59 35.03,53.65 35.74,54.36 37.4,54.36 SV1.24
  Bottom 0.152: v39.78,30.96 39.78,34.87 v40.39,35.48
SIG1  (via drill 0.35)
  Top 0.152: AMP1.3 22.18,19.68 v22.17,19.68 | v22.78,43.41 23.57,44.2 MP1.1
  Bottom 0.152: v22.17,19.68 22.17,42.8 v22.78,43.41
SIG2
  Top 0.152: AMP2.3 64.3,19.68 65.41,18.57 67.47,18.57 70.26,21.36 70.26,33.88 68.25,35.89 66.88,35.89 66.42,36.34 MP2.1
SIG3  (via drill 0.35)
  Top 0.152: MP3.1 39.18,13.57 39.04,13.72 v39.01,13.69 | v40.62,17.65 42.78,17.65 AMP3.3
  Bottom 0.152: v39.01,13.69 39.01,16.05 v40.62,17.65
VD1
  Top 0.152: R4_10Ω.2 35.37,37.27 DAC1.1
VD2
  Top 0.152: R2-4.2 62.15,39.62 DAC2.1
VD3
  Top 0.152: R3-4.2 47.37,32.27 DAC3.1
VIN
  Top 0.152: PS1.1 13.16,6.71 6.3,6.71 J2.1 4.42,20.7 7.24,23.52 9.63,23.52 10.11,24 10.11,28.84 SV6.14
VOUT  (via drill 0.35)
  Top 0.152: AMP1.8 v28.19,22.35 28.5,22.66 C_CR1-3.2 | v47.19,20.09 v47.2,20.09 AMP3.8 47.63,19.4 C_CR1-4.2 | AMP2.8 v66.2,22.07 v66.19,22.07 66.19,22.78 C_CR1-5.2
  Bottom 0.152: PS1.3 28.19,9.28 v28.19,22.35 30.45,20.09 v47.19,20.09 64.21,20.09 v66.19,22.07
W0-1
  Top 0.152: R2_10Ω.1 27,33.86 CR1.1 CR1.2 26.26,32.08 27.81,32.08 28.17,31.72 28.17,24.28 26.8,22.91 26.8,20.48 27.41,19.87 28,19.87 AMP1.6
W0-2
  Top 0.152: AMP2.6 66,19.87 65.41,19.87 61.11,24.16 61.11,31.14 59.98,32.27 CR2.2 CR2.1 59.06,34.29 R2_Ω.1
W1-3
  Top 0.152: AMP3.6 47,17.87 46.41,17.87 44.27,20 44.27,26.59 43.59,27.27 CR3.2 CR3.1 42.06,28.79 R3-2.1
W_TEST1
  Top 0.152: JP1.1 20.07,29.68 CR1.6 CR1.7
W_TEST2
  Top 0.152: JP2.1 54.57,31.92 57.46,29.02 CR2.7 CR2.6
W_TEST3  (via drill 0.35)
  Top 0.152: CR3.12 CR3.13 v46.21,23.38 v46.2,23.37
  Bottom 0.152: v46.2,23.37 54.6,23.37 JP3.1
WP  (via drill 0.35)
  Top 0.152: CR1.5 v22.94,30.33 | CR3.5 v40.62,25.33 | v57.35,30.33 v57.36,30.32 CR2.5
  Bottom 0.152: SV1.19 32.57,52.07 31.65,52.07 28.47,48.9 28.47,34.16 24.64,30.33 v22.94,30.33 22.94,27.85 25.46,25.32 43.54,25.32 43.53,25.33 v40.62,25.33 53.29,25.33 57.35,29.39 v57.35,30.33

### Text on the board
tNames: S3 | SDA3 | SDA2 | SDA1 | SCL1 | S0 | S1 | S2 | WP | SCL3 | SCL2 | 1k | 1k | 1k | 1k | 1k | 1k | 10u | → | ← | → | ← | → | ← | 0.1u | 10u | 0.1u | 0.1u | 10u | R2 | R4 | 0.1u | → | ← | R2 | R4 | 10u | 10u | 0.1u | → | R2 | R4 | → | 0.1u | → | 10u | → | → | → | V+ | → | Ikemoto Lab | designed by GOTO